# EAGLE design pam2803-boost-driver-13mm-mk-2.0 (EAGLE 7.5.0)
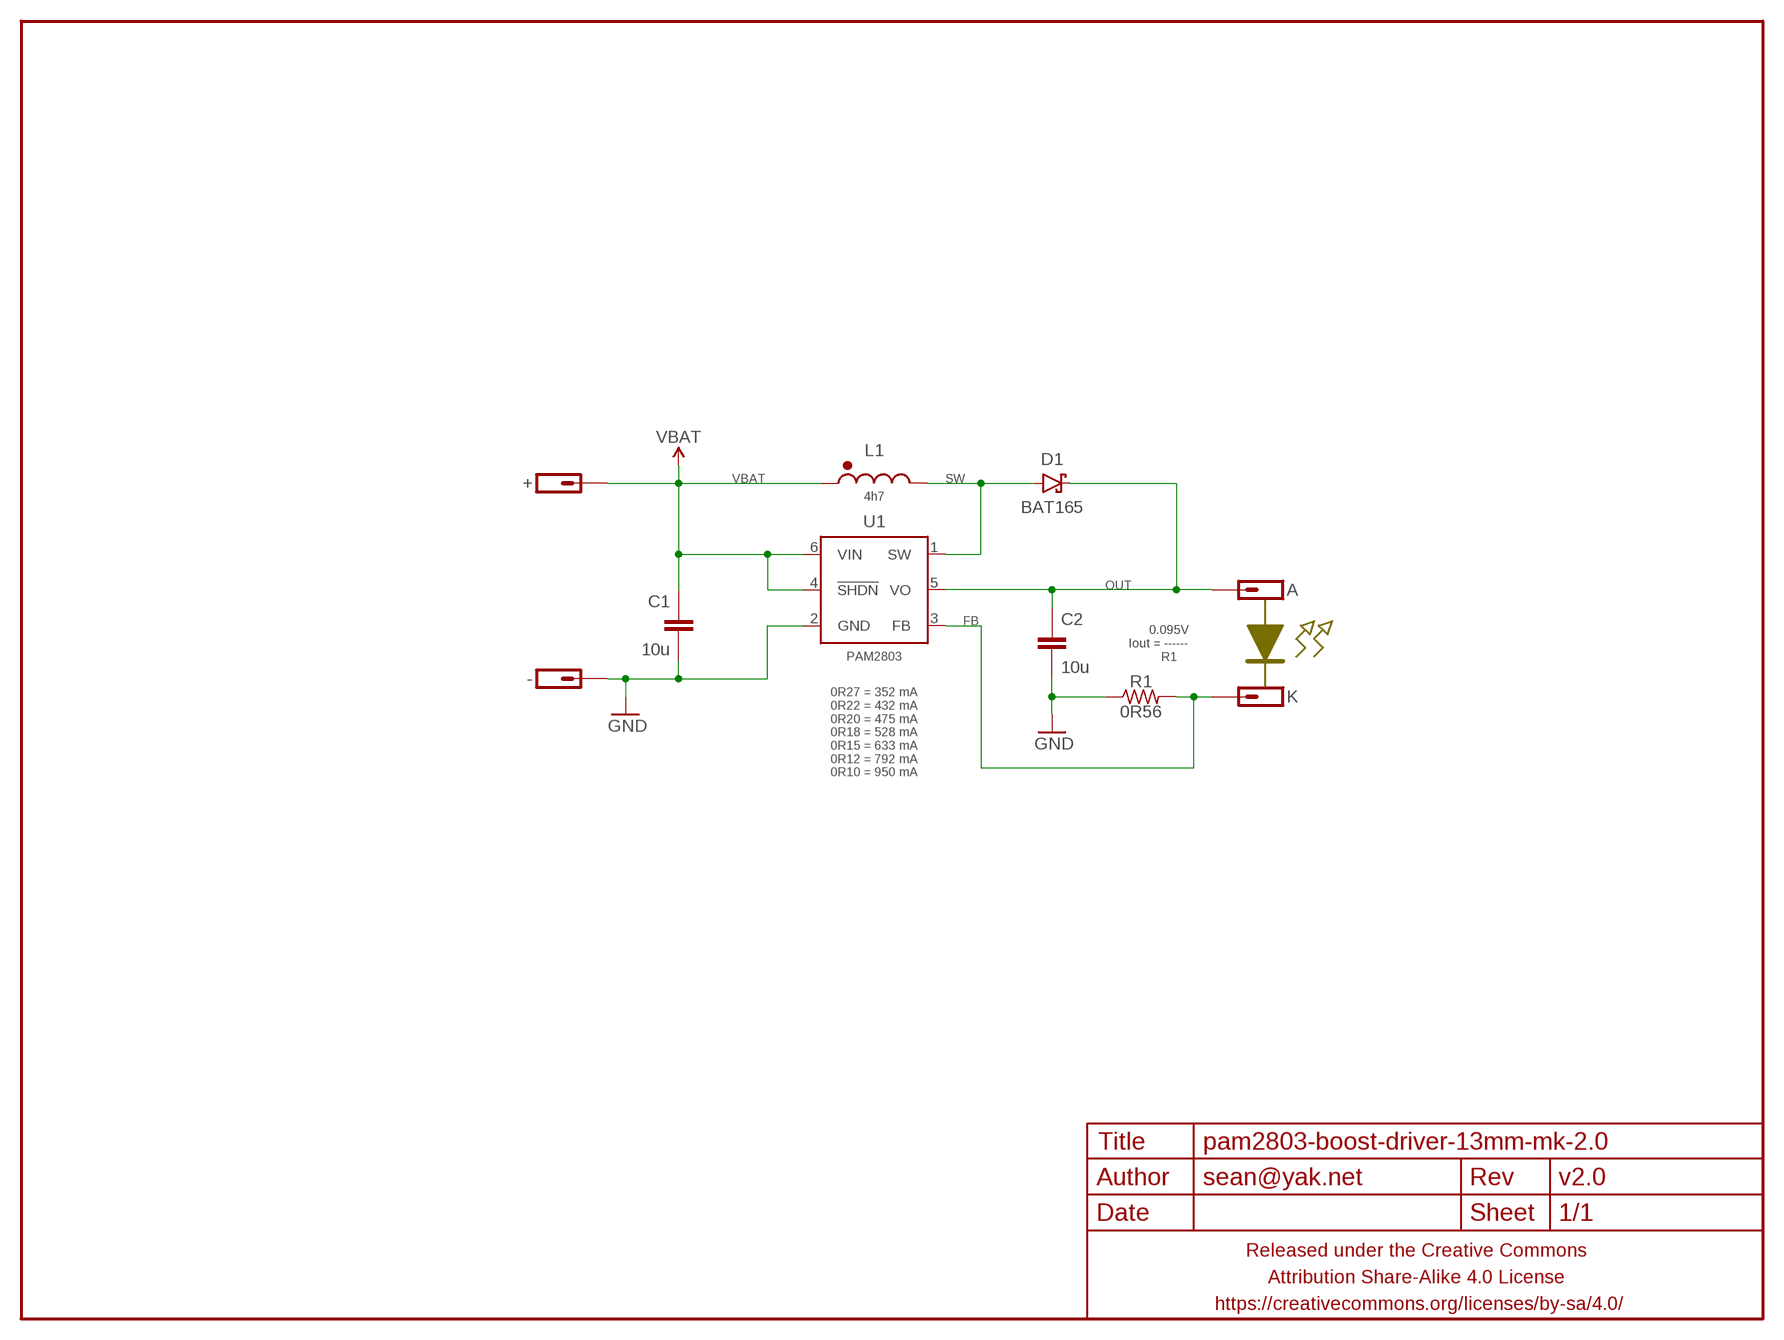
[diagram p0: schematic, sheet 1]

## Parts
+  M01NOT-A-VIA-NOPE  [1X01_NOSILK_NOSTOP]
-  M01NOT-A-VIA-NOPE  [1X01_NOSILK_NOSTOP]
A  M01SMD-1.5MM-DIA-NS  [1X01-SMD-1.5MM-DIA-NS]
C1  10u  CAPACITOR-CERAMICC0603-TIGHTER  [C0603-TIGHTER]
C2  10u  CAPACITOR-CERAMICC0603-TIGHTER  [C0603-TIGHTER]
D1  BAT165  DIODE-SCHOTTKYSOD323  [SOD323-SCHOTTKY]
FRAME1  FRAME-LETTERNO_PACKAGE  [DUMMY]
K  M01SMD-1.5MM-DIA-NS  [1X01-SMD-1.5MM-DIA-NS]
L1  4h7  INDUCTOREPL2014  [EPL2014]
R1  0R56  RESISTORR0603-TIGHTER  [R0603-TIGHTER]
U1  PAM2803  PAM2803SOT23-6  [SOT23-6]

## Nets
FB: K.P$1 R1.2 U1.3(FB)
GND: -.P$1 C1.2 C2.2 R1.1 U1.2(GND)
OUT: A.P$1 C2.1 D1.C U1.5(VO)
SW: D1.A L1.P$2 U1.1(SW)
VBAT: +.P$1 C1.1 L1.P$1 U1.4(!SHDN) U1.6(VIN)

## Notes on the sheet
- 0.095V
  Iout = ------
        R1
- 0R27 = 352 mA
  0R22 = 432 mA
  0R20 = 475 mA
  0R18 = 528 mA
  0R15 = 633 mA
  0R12 = 792 mA
  0R10 = 950 mA

## Library data of the parts
+ - A K = a_parts:M01: Header 1 Standard 1-pin 0.1" header. Use with straight break away headers (SKU : PRT-00116), right angle break away headers (PRT-00553), swiss pins (PRT-00743), machine pins (PRT-00117), and female headers (PRT-00115).
C1 C2 = a_parts:CAPACITOR-CERAMIC: CAPACITOR, European symbol
D1 = a_parts:DIODE-SCHOTTKY: Schottky diodes in SFE's production catalog BAT20J 1A 23V 0.62Vf RB751 120mA 40V 0.37Vf PMEG4005EJ 0.5A 40V 0.42Vf MBRA140 1A 40V 0.5Vf B340A 3A 40V SMA
FRAME1 = a_parts:FRAME-LETTER: Schematic Frame Standard 8.5x11 US Letter frame; DESIGNER: sean@yak.net; VERSION: v2.0
L1 = a_parts:INDUCTOR: Inductors Basic Inductor/Choke - 0603 and 1206. Footprints are not proven and vary greatly between part numbers. SRN6045- 33uH, 20% 1.4A SDR0403-560KL - 56uH, 10%, 500mA RMS/740mA peak
R1 = a_parts:RESISTOR: RESISTOR, American symbol
U1 = a_parts:PAM2803

## Board
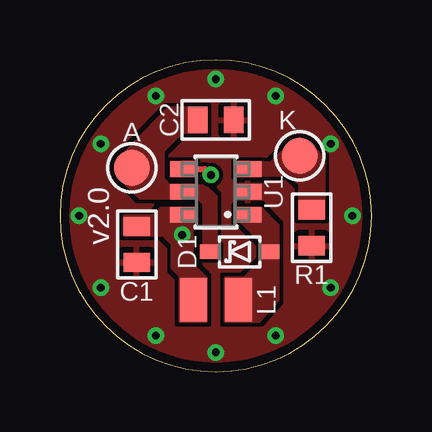
[diagram p1: board, top side]
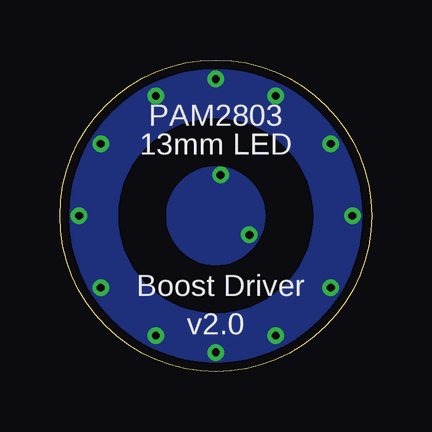
[diagram p2: board, bottom side, seen from below]

Size 13 x 13 mm. Coordinates in mm from the lower left corner, seen from the top.
Outline: 0,6.5 arc180 13,6.5 arc180 0,6.5
Copper layers (1*16): Top 0.0356mm / dielectric 1.5011mm / Bottom 0.0356mm
Design rules "LaenPCBOrder2": minimum track width 6mil, minimum drill 13mil, track to track 6mil, track to pad 6mil, pad to pad 6mil, via to via 6mil, smd to smd 6mil, copper to edge 15mil, drill to drill 6mil, minimum pad ring 7mil, minimum via ring 7mil, stop-mask expansion 3mil, vias tented up to drill 20mil, thermal gap 10mil

### Footprints (pad centres in the part's own frame; a part is rotated, then mirrored left to right if it is on the bottom)
1X01_NOSILK_NOSTOP = drill 0.33: P$1 0,0
1X01-SMD-1.5MM-DIA-NS = smd 1.5 x 1.5: P$1 0,0
C0603-TIGHTER = smd 0.8 x 1.1: 1 -0.75,0; 2 0.75,0
SOD323-SCHOTTKY = smd 0.8 x 0.6: A -1.25,0; C 1.25,0
EPL2014 = smd 1.125 x 1.8: P$1 -0.938,0; P$2 0.938,0
R0603-TIGHTER = smd 0.8 x 1.1: 1 -0.75,0; 2 0.75,0
SOT23-6 = smd 0.65 x 1.1: 1 -0.95,-1.35; 2 0,-1.35; 3 0.95,-1.35; 4 0.95,1.35; 5 0,1.35; 6 -0.95,1.35

### Placement (x,y rotation side)
+  5.1,5.7 0 bottom
-  0.8,6.5 90 bottom
A  3,8.5 180 top
C1  3.2,5.3 270 top
C2  6.5,10.5 0 top
D1  7.5,5 180 top
FRAME1  0,0 0 top
K  10,9 0 top
L1  6.5,3 0 top
R1  10.5,6 90 top
U1  6.5,7.5 90 top

### Tracks (layer width: path | path; a pad name or v marks a point on that pad's centre or on a via)
FB
  pour Top (isolate 0.152, rank 5, no thermals): 7.4,8.7 7.4,8.2 9.6,8.2 10,7.8 10,6.4 11,6.4 11,8.9 10.4,9.5 9.6,9.5 8.8,8.7
GND  (via drill 0.33)
  other vias: 12.2,6.5 6.5,0.8 6.5,12.2 1.7,9.5 4,11.5 11.3,9.5 9,11.5 1.7,3.5 4,1.5 9,1.5 11.3,3.5
  pour Top (isolate 0.152, rank 6): 0,0 0,13 13,13 13,0
  pour Bottom (isolate 0.305, rank 6): 0,0 0,13 13,13 13,0
  cutout Bottom (isolate 0.152, no thermals): 2.5,6.5 arc-90 6.5,10.5 arc-90 10.5,6.5 9,6.5 arc90 6.5,9 arc90 4,6.5
  cutout Bottom (isolate 0.152, no thermals): 10.5,6.5 arc-90 6.5,2.5 arc-90 2.5,6.5 4,6.5 arc90 6.5,4 arc90 9,6.5
  pour Top (isolate 0.152, no thermals): 6.9,8.1 7,8.1 7.3,7.8 8.5,7.8 8.6,7.9 8.8,7.9 8.8,7 8.7,7 8.5,7.2 7.2,7.2 7,6.9 6.9,6.9
OUT
  pour Top (isolate 0.152, rank 5, no thermals): 2.6,9 2.6,8 3.35,7.25 5.75,7.25 6,7 6,4.8 6.5,4.8 6.5,7.3 6.05,7.75 4.6,7.75 4.3,8.05 4.3,9.2 5.1,10 6.1,10 6.1,11 4.5,11
SW
  pour Top (isolate 0.152, rank 5, no thermals): 6.9,3.9 6.9,2.1 8.3,2.1 9.1,3 9.1,6.1 8.4,6.8 7.4,6.8 7.4,6.4 8.4,5.4 8.4,4.6 7.7,3.9
VBAT  (via drill 0.33)
  Top 0.254: U1.4 6.05,8.45 v6.3,8.2
  pour Bottom (isolate 0.152, no thermals): 6.5,4.5 arc-90 4.5,6.5 arc-90 6.5,8.5 arc-90 8.5,6.5 arc-90
  pour Top (isolate 0.152, rank 5, no thermals): 5.6,6.8 4.2,6.8 3.9,6.5 2.7,6.5 2.7,5.7 4.3,5.7 4.7,5.3 4.7,4.3 5,4 5,2.1 6.1,2.1 6.1,3.9 5.5,4.5 5.5,6.2 5.6,6.3

### Text on the board
bPlace: PAM2803 | 13mm LED | Boost Driver